# Altium project k210-core.PrjPcb
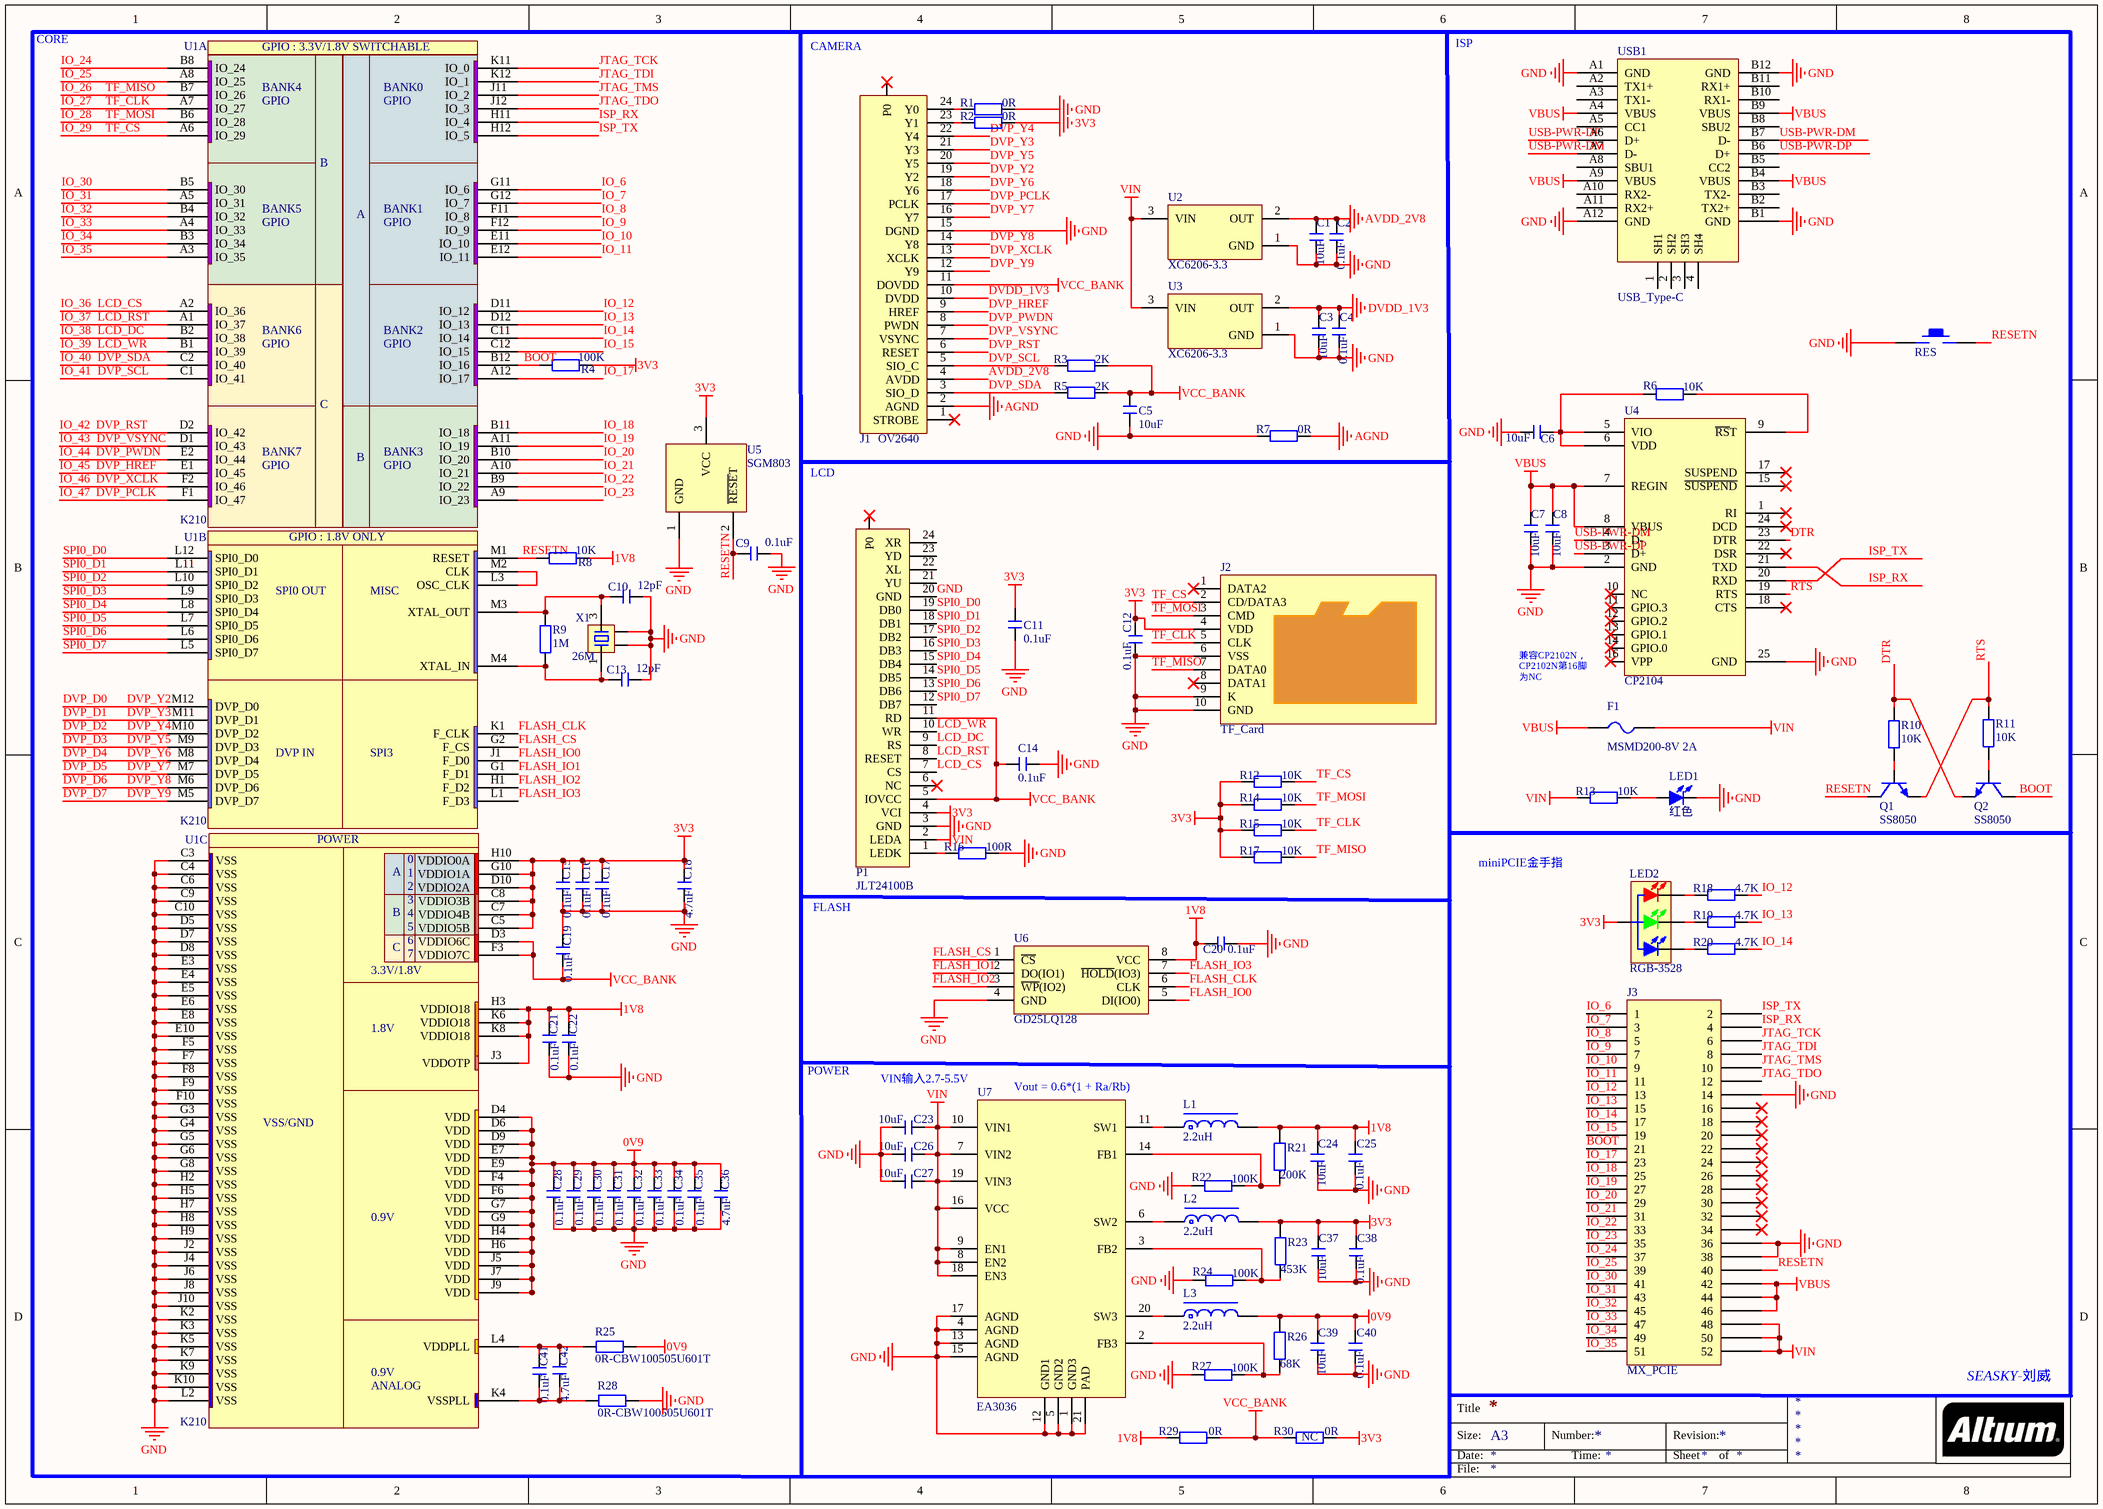
[diagram p0: k210-core.SchDoc]
1 sheet, 94 parts. Net scope: global (net labels, ports and power ports of the same name join across sheets).
Board file: k210-core.PcbDoc

## Sheet k210-core.SchDoc
size A3

### Parts
C1  10uF  [C 0402_M]
C2  0.1uF  [C 0402_M]
C3  10uF  [C 0402_M]
C4  0.1uF  [C 0402_M]
C5  10uF  [C 0402_M]
C6  10uF  [C 0402_M]
C7  10uF  [C 0402_M]
C8  10uF  [C 0402_M]
C9  0.1uF  [C 0402_M]
C10  12pF  [C 0402_M]
C11  0.1uF  [C 0402_M]
C12  0.1uF  [C 0402_M]
C13  12pF  [C 0402_M]
C14  0.1uF  [C 0402_M]
C15  0.1uF  [C 0402_M]
C16  0.1uF  [C 0402_M]
C17  0.1uF  [C 0402_M]
C18  4.7uF  [C 0402_M]
C19  0.1uF  [C 0402_M]
C20  0.1uF  [C 0402_M]
C21  0.1uF  [C 0402_M]
C22  0.1uF  [C 0402_M]
C23  10uF  [C 0402_M]
C24  10uF  [C 0402_M]
C25  0.1uF  [C 0402_M]
C26  10uF  [C 0402_M]
C27  10uF  [C 0402_M]
C28  0.1uF  [C 0402_M]
C29  0.1uF  [C 0402_M]
C30  0.1uF  [C 0402_M]
C31  0.1uF  [C 0402_M]
C32  0.1uF  [C 0402_M]
C33  0.1uF  [C 0402_M]
C34  0.1uF  [C 0402_M]
C35  0.1uF  [C 0402_M]
C36  4.7uF  [C 0402_M]
C37  10uF  [C 0402_M]
C38  0.1uF  [C 0402_M]
C39  10uF  [C 0402_M]
C40  0.1uF  [C 0402_M]
C41  0.1uF  [C 0402_M]
C42  4.7uF  [C 0402_M]
F1  MSMD200-8V 2A  [FU 1210]
J1  OV2640  [FFC/SM0.5-2H24-OV5640]
J2  TF_Card  [TF-SOCKET - short]
J3  MX_PCIE  [miniPCIE]
L1  2.2uH  [NR2520]
L2  2.2uH  [NR2520]
L3  2.2uH  [NR2520]
LED1  红色  [LED 0805G]
LED2  RGB-3528  [LED 3528-4Pin]
P1  JLT24100B  [FFC/SM0.5-2H24-LCD]
Q1  SS8050  [SOT23-3N]
Q2  SS8050  [SOT23-3N]
R1  0R  [R 0402_M]
R2  0R  [R 0402_M]
R3  2K  [R 0402_M]
R4  100K  [R 0402_M]
R5  2K  [R 0402_M]
R6  10K  [R 0402_M]
R7  0R  [R 0402_M]
R8  10K  [R 0402_M]
R9  1M  [R 0402_M]
R10  10K  [R 0402_M]
R11  10K  [R 0402_M]
R12  10K  [R 0402_M]
R13  10K  [R 0402_M]
R14  10K  [R 0402_M]
R15  10K  [R 0402_M]
R16  100R  [R 0402_M]
R17  10K  [R 0402_M]
R18  4.7K  [R 0402_M]
R19  4.7K  [R 0402_M]
R20  4.7K  [R 0402_M]
R21  200K  [R 0402_M]
R22  100K  [R 0402_M]
R23  453K  [R 0402_M]
R24  100K  [R 0402_M]
R25  0R-CBW100505U601T  [R 0402_M]
R26  68K  [R 0402_M]
R27  100K  [R 0402_M]
R28  0R-CBW100505U601T  [R 0402_M]
R29  0R  [R 0402_M]
R30  0R  [R 0402_M]
RST1  RES  [SMD-3.2*4.2]
U1  K210  [BGA144C65P12X12_800X800X95]  (parts A,B,C of 3)
U2  XC6206-3.3  [SOT23-3N]
U3  XC6206-3.3  [SOT23-3N]
U4  CP2104  [QFN-24_L4.0-W4.0-P0.50-BL-EP2.8]
U5  SGM803  [SOT23-3N]
U6  GD25LQ128  [WSON-8_L8.0-W6.10-P1.27-BL-EP]
U7  EA3036  [QFN20_40P300X300X80_HS-21N]
USB1  USB_Type-C  [Type-C-TOP]
X1  26M  [OSC 3225-4P]

### Nets
0V9: C28.1 C29.1 C30.1 C31.1 C32.1 C33.1 C34.1 C35.1 C36.1 C39.2 C40.2 L3.2 R25.2 R26.2 U1.D4(VDD) U1.D6(VDD) U1.D9(VDD) U1.E7(VDD) U1.E9(VDD) U1.F4(VDD) U1.F6(VDD) U1.G7(VDD) U1.G9(VDD) U1.H4(VDD) U1.H6(VDD) U1.J5(VDD) U1.J7(VDD) U1.J9(VDD)
1V8: C20.2 C21.1 C22.1 C24.2 C25.2 L1.2 R8.2 R21.2 R29.2 U1.H3(VDDIO18) U1.J3(VDDOTP) U1.K6(VDDIO18) U1.K8(VDDIO18) U6.8(VCC)
3V3: C11.1 C12.1 C15.2 C16.2 C17.2 C18.2 C37.2 C38.2 J2.4(VDD) L2.2 LED2.4(A) P1.4(VCI) R2.2 R4.2 R12.1 R14.1 R15.1 R17.1 R23.2 R30.1 U1.C5(VDDIO5B) U1.C7(VDDIO4B) U1.C8(VDDIO3B) U1.D10(VDDIO2A) U1.G10(VDDIO1A) U1.H10(VDDIO0A) U5.3(VCC)
AGND: J1.2(AGND) R7.2
AVDD_2V8: C1.2 C2.2 J1.4(AVDD) U2.2(OUT)
DVDD_1V3: C3.2 C4.2 J1.10(DVDD) U3.2(OUT)
GND: C1.1 C2.1 C3.1 C4.1 C5.2 C6.2 C7.1 C8.1 C9.2 C10.2 C11.2 C12.2 C13.2 C14.1 C15.1 C16.1 C17.1 C18.1 C19.1 C20.1 C21.2 C22.2 C23.2 C24.1 C25.1 C26.2 C27.2 C28.2 C29.2 C30.2 C31.2 C32.2 C33.2 C34.2 C35.2 C36.2 C37.1 C38.1 C39.1 C40.1 J1.15(DGND) J2.6(VSS) J2.9(K) J2.10(GND) J3.14 J3.36 J3.38 LED1.2(K) P1.3(GND) P1.20(GND) R1.2 R7.1 R16.2 R22.2 R24.2 R27.2 R28.2 RST1.1 U1.C3(VSS) U1.C4(VSS) U1.C6(VSS) U1.C9(VSS) U1.C10(VSS) U1.D5(VSS) U1.D7(VSS) U1.D8(VSS) U1.E3(VSS) U1.E4(VSS) U1.E5(VSS) U1.E6(VSS) U1.E8(VSS) U1.E10(VSS) U1.F5(VSS) U1.F7(VSS) U1.F8(VSS) U1.F9(VSS) U1.F10(VSS) U1.G3(VSS) U1.G4(VSS) U1.G5(VSS) U1.G6(VSS) U1.G8(VSS) U1.H2(VSS) U1.H5(VSS) U1.H7(VSS) U1.H8(VSS) U1.H9(VSS) U1.J2(VSS) U1.J4(VSS) U1.J6(VSS) U1.J8(VSS) U1.J10(VSS) U1.K2(VSS) U1.K3(VSS) U1.K5(VSS) U1.K7(VSS) U1.K9(VSS) U1.K10(VSS) U1.L2(VSS) U2.1(GND) U3.1(GND) U4.2(GND) U4.25(GND) U5.1(GND) U6.4(GND) U7.1(GND3) U7.4(AGND) U7.5(GND2) U7.12(GND1) U7.13(AGND) U7.15(AGND) U7.17(AGND) U7.21(PAD) USB1.A1(GND) USB1.A12(GND) USB1.B1(GND) USB1.B12(GND) X1.2 X1.4
VBUS: C7.2 C8.2 F1.1 J3.42 J3.44 J3.46 U4.7(REGIN) U4.8(VBUS) USB1.A4(VBUS) USB1.A9(VBUS) USB1.B4(VBUS) USB1.B9(VBUS)
VCC_BANK: C5.1 C14.2 C19.2 J1.11(DOVDD) P1.5(IOVCC) P1.11(RD) R3.2 R5.2 R29.1 R30.2 U1.D3(VDDIO6C) U1.F3(VDDIO7C)
VIN: C23.1 C26.1 C27.1 F1.2 J3.48 J3.50 J3.52 P1.2(LEDA) R13.1 U2.3(VIN) U3.3(VIN) U7.7(VIN2) U7.8(EN2) U7.9(EN1) U7.10(VIN1) U7.16(VCC) U7.18(EN3) U7.19(VIN3)
BOOT: J3.21 Q2.3(C) R4.1 U1.B12(IO_16)
DTR: Q2.2(E) R10.1 U4.23(DTR)
DVP_D0: J1.19(Y2) U1.M12(DVP_D0)  [also labelled DVP_Y2]
DVP_D1: J1.21(Y3) U1.M11(DVP_D1)  [also labelled DVP_Y3]
DVP_D2: J1.22(Y4) U1.M10(DVP_D2)  [also labelled DVP_Y4]
DVP_D3: J1.20(Y5) U1.M9(DVP_D3)  [also labelled DVP_Y5]
DVP_D4: J1.18(Y6) U1.M8(DVP_D4)  [also labelled DVP_Y6]
DVP_D5: J1.16(Y7) U1.M7(DVP_D5)  [also labelled DVP_Y7]
DVP_D6: J1.14(Y8) U1.M6(DVP_D6)  [also labelled DVP_Y8]
DVP_D7: J1.12(Y9) U1.M5(DVP_D7)  [also labelled DVP_Y9]
DVP_HREF: J1.9(HREF) U1.E1(IO_45)  [also labelled IO_45]
DVP_PCLK: J1.17(PCLK) U1.F1(IO_47)  [also labelled IO_47]
DVP_PWDN: J1.8(PWDN) U1.E2(IO_44)  [also labelled IO_44]
DVP_RST: J1.6(RESET) U1.D2(IO_42)  [also labelled IO_42]
DVP_SCL: J1.5(SIO_C) R3.1 U1.C1(IO_41)  [also labelled IO_41]
DVP_SDA: J1.3(SIO_D) R5.1 U1.C2(IO_40)  [also labelled IO_40]
DVP_VSYNC: J1.7(VSYNC) U1.D1(IO_43)  [also labelled IO_43]
DVP_XCLK: J1.13(XCLK) U1.F2(IO_46)  [also labelled IO_46]
FLASH_CLK: U1.K1(F_CLK) U6.6(CLK)
FLASH_CS: U1.G2(F_CS) U6.1(~{CS})
FLASH_IO0: U1.J1(F_D0) U6.5(DI(IO0))
FLASH_IO1: U1.G1(F_D1) U6.2(DO(IO1))
FLASH_IO2: U1.H1(F_D2) U6.3(~{WP}(IO2))
FLASH_IO3: U1.L1(F_D3) U6.7(~{HOLD}(IO3))
IO_6: J3.1 U1.G11(IO_6)
IO_7: J3.3 U1.G12(IO_7)
IO_8: J3.5 U1.F11(IO_8)
IO_9: J3.7 U1.F12(IO_9)
IO_10: J3.9 U1.E11(IO_10)
IO_11: J3.11 U1.E12(IO_11)
IO_12: J3.13 R18.2 U1.D11(IO_12)
IO_13: J3.15 R19.2 U1.D12(IO_13)
IO_14: J3.17 R20.2 U1.C11(IO_14)
IO_15: J3.19 U1.C12(IO_15)
IO_17: J3.23 U1.A12(IO_17)
IO_18: J3.25 U1.B11(IO_18)
IO_19: J3.27 U1.A11(IO_19)
IO_20: J3.29 U1.B10(IO_20)
IO_21: J3.31 U1.A10(IO_21)
IO_22: J3.33 U1.B9(IO_22)
IO_23: J3.35 U1.A9(IO_23)
IO_24: J3.37 U1.B8(IO_24)
IO_25: J3.39 U1.A8(IO_25)
IO_26: J2.7(DATA0) R17.2 U1.B7(IO_26)  [also labelled TF_MISO]
IO_27: J2.5(CLK) R15.2 U1.A7(IO_27)  [also labelled TF_CLK]
IO_28: J2.3(CMD) R14.2 U1.B6(IO_28)  [also labelled TF_MOSI]
IO_29: J2.2(CD/DATA3) R12.2 U1.A6(IO_29)  [also labelled TF_CS]
IO_30: J3.41 U1.B5(IO_30)
IO_31: J3.43 U1.A5(IO_31)
IO_32: J3.45 U1.B4(IO_32)
IO_33: J3.47 U1.A4(IO_33)
IO_34: J3.49 U1.B3(IO_34)
IO_35: J3.51 U1.A3(IO_35)
IO_36: P1.7(CS) U1.A2(IO_36)  [also labelled LCD_CS]
IO_37: P1.8(RESET) U1.A1(IO_37)  [also labelled LCD_RST]
IO_38: P1.9(RS) U1.B2(IO_38)  [also labelled LCD_DC]
IO_39: P1.10(WR) U1.B1(IO_39)  [also labelled LCD_WR]
ISP_RX: J3.4 U1.H11(IO_4) U4.21(TXD)
ISP_TX: J3.2 U1.H12(IO_5) U4.20(RXD)
JTAG_TCK: J3.6 U1.K11(IO_0)
JTAG_TDI: J3.8 U1.K12(IO_1)
JTAG_TDO: J3.12 U1.J12(IO_3)
JTAG_TMS: J3.10 U1.J11(IO_2)
RESETN: C9.1 J3.40 Q1.3(C) R8.1 RST1.2 U1.M1(RESET) U5.2(~{RESE}T)
RTS: Q1.2(E) R11.1 U4.19(RTS)
SPI0_D0: P1.19(DB0) U1.L12(SPI0_D0)
SPI0_D1: P1.18(DB1) U1.L11(SPI0_D1)
SPI0_D2: P1.17(DB2) U1.L10(SPI0_D2)
SPI0_D3: P1.16(DB3) U1.L9(SPI0_D3)
SPI0_D4: P1.15(DB4) U1.L8(SPI0_D4)
SPI0_D5: P1.14(DB5) U1.L7(SPI0_D5)
SPI0_D6: P1.13(DB6) U1.L6(SPI0_D6)
SPI0_D7: P1.12(DB7) U1.L5(SPI0_D7)
USB-PWR-DM: U4.4(D-) USB1.A7(D-) USB1.B7(D-)
USB-PWR-DP: U4.3(D+) USB1.A6(D+) USB1.B6(D+)
NetC6_1: C6.1 R6.2 U4.5(VIO) U4.6(VDD)
NetC10_1: C10.1 R9.2 U1.M3(XTAL_OUT) X1.3
NetC13_1: C13.1 R9.1 U1.M4(XTAL_IN) X1.1
NetC41_1: C41.1 C42.1 R25.1 U1.L4(VDDPLL)
NetC41_2: C41.2 C42.2 R28.1 U1.K4(VSSPLL)
NetJ1_23: J1.23(Y1) R2.1
NetJ1_24: J1.24(Y0) R1.1
NetL1_1: L1.1 U7.11(SW1)
NetL2_1: L2.1 U7.6(SW2)
NetL3_1: L3.1 U7.20(SW3)
NetLED1_1: LED1.1(A) R13.2
NetLED2_1: LED2.1(RED_K) R18.1
NetLED2_2: LED2.2(GREEN_K) R19.1
NetLED2_3: LED2.3(BULE_K) R20.1
NetP1_1: P1.1(LEDK) R16.1
NetQ1_1: Q1.1(B) R10.2
NetQ2_1: Q2.1(B) R11.2
NetR6_1: R6.1 U4.9(~{RS}T)
NetR21_1: R21.1 R22.1 U7.14(FB1)
NetR23_1: R23.1 R24.1 U7.3(FB2)
NetR26_1: R26.1 R27.1 U7.2(FB3)
NetU1_L3: U1.L3(OSC_CLK) U1.M2(CLK)

Not connected (* = marked no-connect by the designer): J1 1(STROBE)* P0*; J2 1(DATA2)* 8(DATA1)*; J3 16* 18* 20* 22* 24* 26* 28* 30* 32* 34*; P1 6(NC)* 21(YU) 22(XL) 23(YD) 24(XR) P0*; U4 1(RI)* 10(NC)* 11(GPIO.3)* 12(GPIO.2)* 13(GPIO.1)* 14(GPIO.0)* 15(~{SUSPEND})* 16(VPP)* 17(SUSPEND)* 18(CTS)* 22(DSR)* 24(DCD)*; USB1 1(SH1) 2(SH2) 3(SH3) 4(SH4) A2(TX1+) A3(TX1-) A5(CC1) A8(SBU1) A10(RX2-) A11(RX2+) B2(TX2+) B3(TX2-) B5(CC2) B8(SBU2) B10(RX1-) B11(RX1+)

### Notes on the sheet
- CORE
- ISP
- CAMERA
- LCD
- 兼容CP2102N，CP2102N第16脚为NC
- FLASH
- miniPCIE金手指
- POWER
- VIN输入2.7-5.5V
- Vout = 0.6*(1 + Ra/Rb)
- SEASKY-刘威
- (near R30) NC
- Title
- Size:
- Date:
- A3
- Number:
- Time:
- Revision:
- Sheet
- of
- File:
- (in symbol K210, part A) GPIO : 3.3V/1.8V SWITCHABLE; BANK4; BANK0; GPIO; B; BANK5; BANK1; A; BANK6; BANK2; C; BANK7; BANK3
- (in symbol K210, part B) GPIO : 1.8V ONLY; SPI0 OUT; MISC; DVP IN; SPI3
- (in symbol K210, part C) POWER; 0; A; 1; 2; 3; B; 4; 5; 6; C; 7; 3.3V/1.8V; 1.8V; VSS/GND; 0.9V; ANALOG

### Library data of the parts
C1-C42 = C: 贴片电容
F1 = FU: 贴片保险丝
J1 = OV5640: Header, 24-Pin; LatestRevisionDate: 17-Jul-2002; LatestRevisionNote: Re-released for DXP Platform.; Publisher: Altium Limited
J2 = TF_Card: TF卡座
J3 = MX_PCIE: mini-PCI-E
L1-L3 = L-NR: NR磁胶电感
LED1 = LED-SMD: 贴片LED
LED2 = LED-RGB 3528: 3528三基色LED
Q1 Q2 = 8050-SMD: 高频放大-NPN型
R1-R30 = R: 贴片电阻
RST1 = KEY_M
U1 = K210: Canaan Kendryte K210 AI SoC; VENDOR: CANAAN INC.
U2 U3 = XC6206-3.3: SOT-23,XC6206P332MR,MAX8V,100mA
U6 = GD25LQ128: WSON-8
X1 = XTAL-4P: 4脚无源晶振
P1 = JLT24100B: LatestRevisionDate: 17-Jul-2002; LatestRevisionNote: Re-released for DXP Platform.; Publisher: Altium Limited